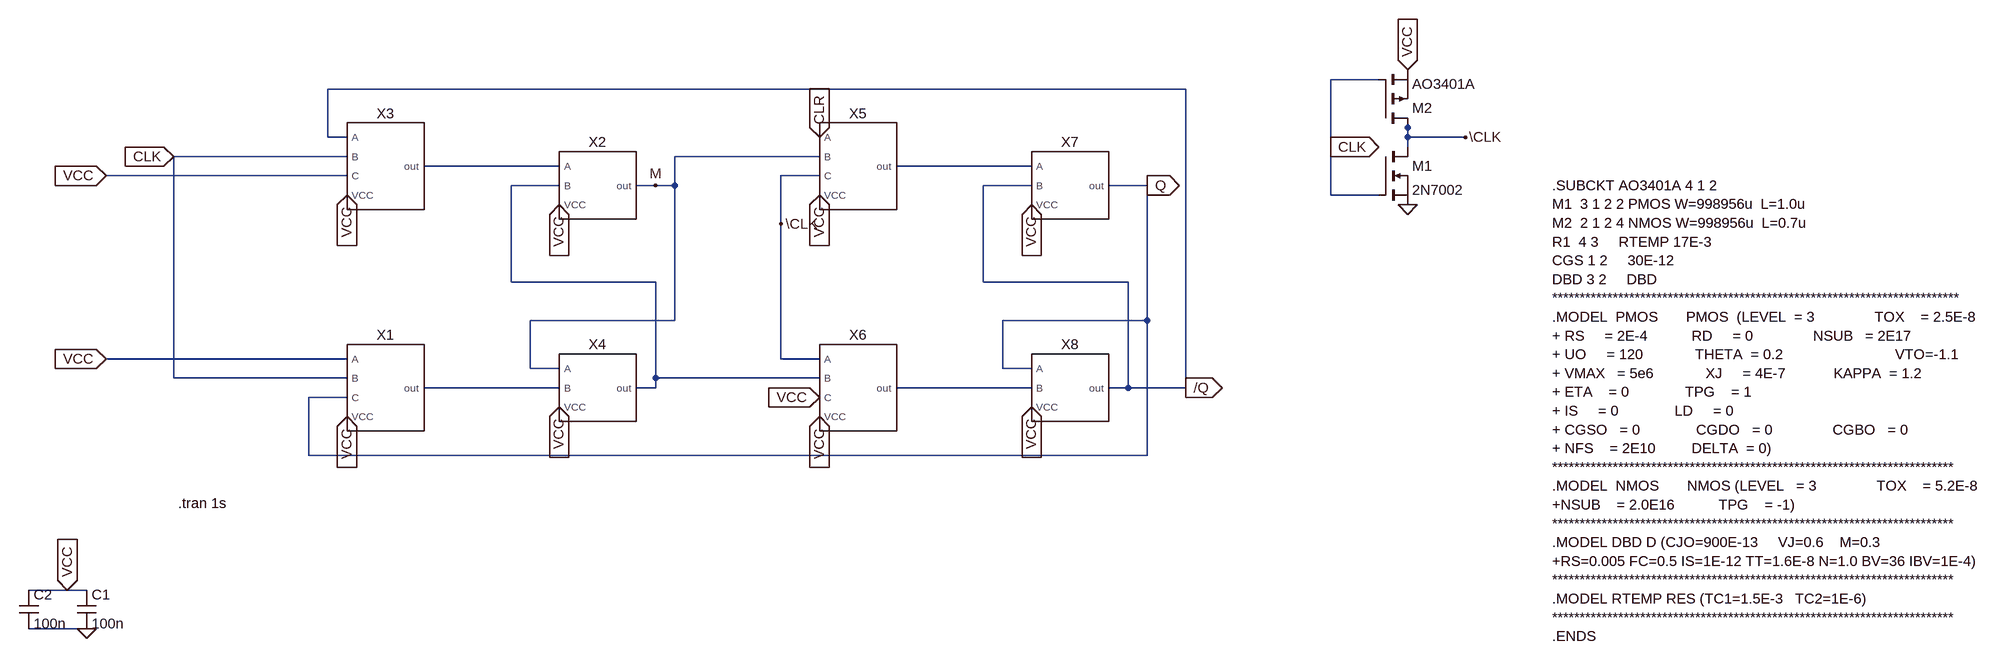
[diagram p0: schematic flipflop-test.asc]
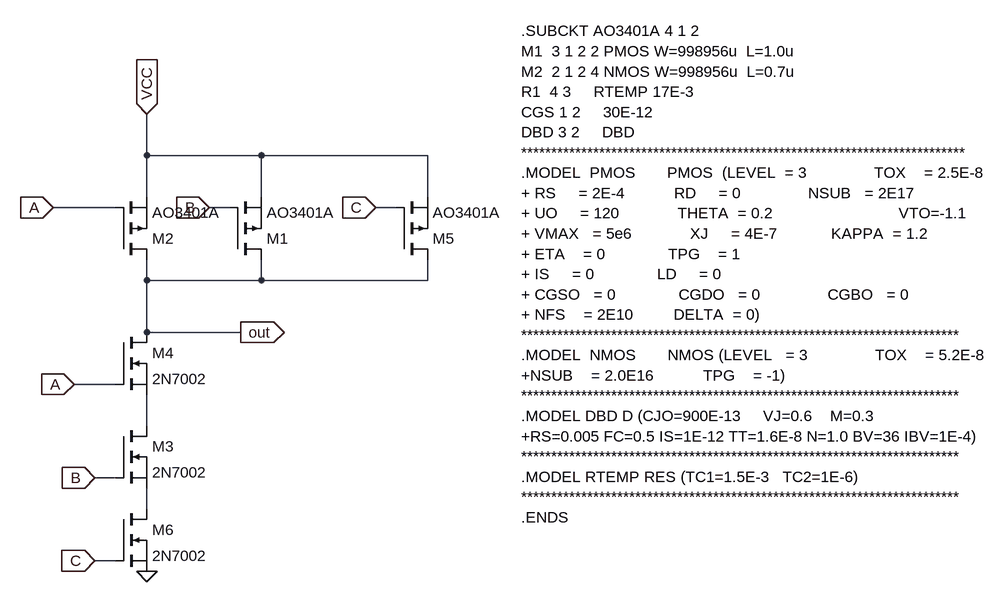
[diagram p1: sub-circuit nand3-gate.asc]
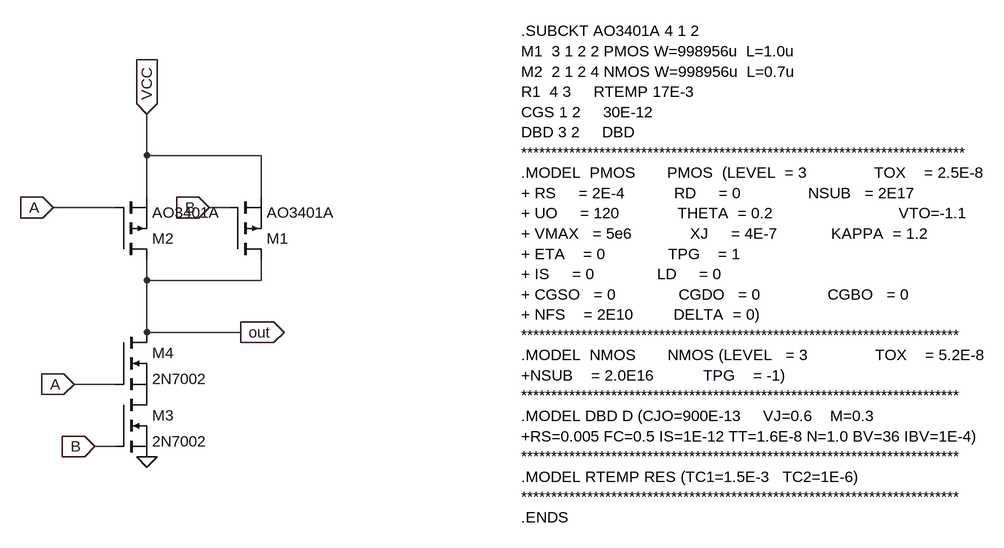
[diagram p2: sub-circuit nand-gate.asc]
flipflop-test.asc, the LTspice schematic file:
Version 4.1
SHEET 1 3088 948
WIRE 1712 -48 1632 -48
WIRE 1392 -32 -32 -32
WIRE 1760 32 1760 16
WIRE -32 48 -32 -32
WIRE 0 48 -32 48
WIRE 1760 48 1760 32
WIRE 1856 48 1760 48
WIRE 1632 64 1632 -48
WIRE 1760 64 1760 48
WIRE 0 80 -288 80
WIRE 784 80 544 80
WIRE 352 96 128 96
WIRE 1136 96 912 96
WIRE 0 112 -400 112
WIRE 784 112 720 112
WIRE 352 128 272 128
WIRE 512 128 480 128
WIRE 544 128 544 80
WIRE 544 128 512 128
WIRE 1136 128 1056 128
WIRE 1328 128 1264 128
WIRE 1632 144 1632 64
WIRE 1712 144 1632 144
WIRE 720 192 720 112
WIRE 272 288 272 128
WIRE 512 288 272 288
WIRE 1056 288 1056 128
WIRE 1296 288 1056 288
WIRE 544 352 544 128
WIRE 544 352 304 352
WIRE 1328 352 1328 128
WIRE 1328 352 1088 352
WIRE 0 416 -400 416
WIRE 720 416 720 192
WIRE 784 416 720 416
WIRE 304 432 304 352
WIRE 352 432 304 432
WIRE 1088 432 1088 352
WIRE 1136 432 1088 432
WIRE -288 448 -288 80
WIRE 0 448 -288 448
WIRE 512 448 512 288
WIRE 784 448 512 448
WIRE 352 464 128 464
WIRE 512 464 512 448
WIRE 512 464 480 464
WIRE 1136 464 912 464
WIRE 1296 464 1296 288
WIRE 1296 464 1264 464
WIRE 1392 464 1392 -32
WIRE 1392 464 1296 464
WIRE 0 480 -64 480
WIRE -64 576 -64 480
WIRE 1328 576 1328 352
WIRE 1328 576 -64 576
WIRE -464 800 -528 800
WIRE -432 800 -464 800
WIRE -432 864 -528 864
FLAG -288 80 CLK
IOPIN -288 80 In
FLAG 1328 128 Q
IOPIN 1328 128 Out
FLAG 1392 464 /Q
IOPIN 1392 464 Out
FLAG 512 128 M
FLAG 1632 64 CLK
IOPIN 1632 64 Out
FLAG 1760 160 0
FLAG 1856 48 \CLK
FLAG 720 192 \CLK
FLAG -400 112 VCC
IOPIN -400 112 In
FLAG -464 800 VCC
IOPIN -464 800 In
FLAG -432 864 0
FLAG -400 416 VCC
IOPIN -400 416 In
FLAG 0 144 VCC
IOPIN 0 144 In
FLAG 0 512 VCC
IOPIN 0 512 In
FLAG 352 496 VCC
IOPIN 352 496 In
FLAG 352 160 VCC
IOPIN 352 160 In
FLAG 784 512 VCC
IOPIN 784 512 In
FLAG 784 480 VCC
IOPIN 784 480 In
FLAG 784 144 VCC
IOPIN 784 144 In
FLAG 1136 160 VCC
IOPIN 1136 160 In
FLAG 1136 496 VCC
IOPIN 1136 496 In
FLAG 1760 -64 VCC
IOPIN 1760 -64 In
FLAG 784 48 CLR
IOPIN 784 48 In
SYMBOL nand3-gate 64 96 R0
SYMATTR InstName X3
SYMBOL nand3-gate 64 464 R0
SYMATTR InstName X1
SYMBOL nand-gate 416 128 R0
SYMATTR InstName X2
SYMBOL nand-gate 416 464 R0
SYMATTR InstName X4
SYMBOL nand3-gate 848 96 R0
SYMATTR InstName X5
SYMBOL nand3-gate 848 464 R0
SYMATTR InstName X6
SYMBOL nand-gate 1200 128 R0
SYMATTR InstName X7
SYMBOL nand-gate 1200 464 R0
SYMATTR InstName X8
SYMBOL nmos 1712 64 R0
SYMATTR InstName M1
SYMATTR Value 2N7002
SYMBOL pmos 1712 32 M180
SYMATTR InstName M2
SYMATTR Value AO3401A
SYMATTR Prefix X
SYMBOL cap -448 800 R0
SYMATTR InstName C1
SYMATTR Value 100n
SYMBOL cap -544 800 R0
SYMATTR InstName C2
SYMATTR Value 100n
TEXT -280 656 Left 2 !.tran 1s
TEXT 2000 128 Left 2 !.SUBCKT AO3401A 4 1 2\nM1  3 1 2 2 PMOS W=998956u  L=1.0u \nM2  2 1 2 4 NMOS W=998956u  L=0.7u\nR1  4 3     RTEMP 17E-3\nCGS 1 2     30E-12\nDBD 3 2     DBD\n**************************************************************************\n.MODEL  PMOS       PMOS  (LEVEL  = 3               TOX    = 2.5E-8\n+ RS     = 2E-4           RD     = 0               NSUB   = 2E17  \n+ UO     = 120             THETA  = 0.2                            VTO=-1.1\n+ VMAX   = 5e6             XJ     = 4E-7            KAPPA  = 1.2\n+ ETA    = 0              TPG    = 1  \n+ IS     = 0              LD     = 0                           \n+ CGSO   = 0              CGDO   = 0               CGBO   = 0 \n+ NFS    = 2E10         DELTA  = 0)\n*************************************************************************\n.MODEL  NMOS       NMOS (LEVEL   = 3               TOX    = 5.2E-8\n+NSUB    = 2.0E16           TPG    = -1)   \n*************************************************************************\n.MODEL DBD D (CJO=900E-13     VJ=0.6    M=0.3\n+RS=0.005 FC=0.5 IS=1E-12 TT=1.6E-8 N=1.0 BV=36 IBV=1E-4)\n*************************************************************************\n.MODEL RTEMP RES (TC1=1.5E-3   TC2=1E-6)\n*************************************************************************\n.ENDS

nand3-gate.asc, the sub-circuit schematic file:
Version 4.1
SHEET 1 2000 824
WIRE 336 128 336 64
WIRE 512 128 336 128
WIRE 768 128 512 128
WIRE 336 192 336 128
WIRE 512 192 512 128
WIRE 768 192 768 128
WIRE 288 208 192 208
WIRE 464 208 432 208
WIRE 720 208 688 208
WIRE 336 320 336 288
WIRE 512 320 512 288
WIRE 512 320 336 320
WIRE 768 320 768 288
WIRE 768 320 512 320
WIRE 336 400 336 320
WIRE 480 400 336 400
WIRE 288 480 224 480
WIRE 336 544 336 496
WIRE 288 624 256 624
WIRE 336 672 336 640
WIRE 288 752 256 752
FLAG 192 208 A
IOPIN 192 208 In
FLAG 224 480 A
IOPIN 224 480 In
FLAG 432 208 B
IOPIN 432 208 In
FLAG 256 624 B
IOPIN 256 624 In
FLAG 480 400 out
IOPIN 480 400 Out
FLAG 256 752 C
IOPIN 256 752 In
FLAG 688 208 C
IOPIN 688 208 In
FLAG 336 768 0
FLAG 336 64 VCC
IOPIN 336 64 In
SYMBOL pmos 464 288 M180
SYMATTR InstName M1
SYMATTR Value AO3401A
SYMATTR Prefix X
SYMBOL pmos 288 288 M180
SYMATTR InstName M2
SYMATTR Value AO3401A
SYMATTR Prefix X
SYMBOL nmos 288 400 R0
SYMATTR InstName M4
SYMATTR Value 2N7002
SYMBOL nmos 288 544 R0
SYMATTR InstName M3
SYMATTR Value 2N7002
SYMBOL pmos 720 288 M180
SYMATTR InstName M5
SYMATTR Value AO3401A
SYMATTR Prefix X
SYMBOL nmos 288 672 R0
SYMATTR InstName M6
SYMATTR Value 2N7002
TEXT 912 -64 Left 2 !.SUBCKT AO3401A 4 1 2\nM1  3 1 2 2 PMOS W=998956u  L=1.0u \nM2  2 1 2 4 NMOS W=998956u  L=0.7u\nR1  4 3     RTEMP 17E-3\nCGS 1 2     30E-12\nDBD 3 2     DBD\n**************************************************************************\n.MODEL  PMOS       PMOS  (LEVEL  = 3               TOX    = 2.5E-8\n+ RS     = 2E-4           RD     = 0               NSUB   = 2E17  \n+ UO     = 120             THETA  = 0.2                            VTO=-1.1\n+ VMAX   = 5e6             XJ     = 4E-7            KAPPA  = 1.2\n+ ETA    = 0              TPG    = 1  \n+ IS     = 0              LD     = 0                           \n+ CGSO   = 0              CGDO   = 0               CGBO   = 0 \n+ NFS    = 2E10         DELTA  = 0)\n*************************************************************************\n.MODEL  NMOS       NMOS (LEVEL   = 3               TOX    = 5.2E-8\n+NSUB    = 2.0E16           TPG    = -1)   \n*************************************************************************\n.MODEL DBD D (CJO=900E-13     VJ=0.6    M=0.3\n+RS=0.005 FC=0.5 IS=1E-12 TT=1.6E-8 N=1.0 BV=36 IBV=1E-4)\n*************************************************************************\n.MODEL RTEMP RES (TC1=1.5E-3   TC2=1E-6)\n*************************************************************************\n.ENDS

nand-gate.asc, the sub-circuit schematic file:
Version 4.1
SHEET 1 2000 712
WIRE 336 128 336 64
WIRE 512 128 336 128
WIRE 336 192 336 128
WIRE 512 192 512 128
WIRE 288 208 192 208
WIRE 464 208 432 208
WIRE 336 320 336 288
WIRE 512 320 512 288
WIRE 512 320 336 320
WIRE 336 400 336 320
WIRE 480 400 336 400
WIRE 288 480 224 480
WIRE 288 576 256 576
FLAG 192 208 A
IOPIN 192 208 In
FLAG 224 480 A
IOPIN 224 480 In
FLAG 432 208 B
IOPIN 432 208 In
FLAG 256 576 B
IOPIN 256 576 In
FLAG 336 592 0
FLAG 480 400 out
IOPIN 480 400 Out
FLAG 336 64 VCC
IOPIN 336 64 In
SYMBOL pmos 464 288 M180
SYMATTR InstName M1
SYMATTR Value AO3401A
SYMATTR Prefix X
SYMBOL pmos 288 288 M180
SYMATTR InstName M2
SYMATTR Value AO3401A
SYMATTR Prefix X
SYMBOL nmos 288 400 R0
SYMATTR InstName M4
SYMATTR Value 2N7002
SYMBOL nmos 288 496 R0
SYMATTR InstName M3
SYMATTR Value 2N7002
TEXT 912 -64 Left 2 !.SUBCKT AO3401A 4 1 2\nM1  3 1 2 2 PMOS W=998956u  L=1.0u \nM2  2 1 2 4 NMOS W=998956u  L=0.7u\nR1  4 3     RTEMP 17E-3\nCGS 1 2     30E-12\nDBD 3 2     DBD\n**************************************************************************\n.MODEL  PMOS       PMOS  (LEVEL  = 3               TOX    = 2.5E-8\n+ RS     = 2E-4           RD     = 0               NSUB   = 2E17  \n+ UO     = 120             THETA  = 0.2                            VTO=-1.1\n+ VMAX   = 5e6             XJ     = 4E-7            KAPPA  = 1.2\n+ ETA    = 0              TPG    = 1  \n+ IS     = 0              LD     = 0                           \n+ CGSO   = 0              CGDO   = 0               CGBO   = 0 \n+ NFS    = 2E10         DELTA  = 0)\n*************************************************************************\n.MODEL  NMOS       NMOS (LEVEL   = 3               TOX    = 5.2E-8\n+NSUB    = 2.0E16           TPG    = -1)   \n*************************************************************************\n.MODEL DBD D (CJO=900E-13     VJ=0.6    M=0.3\n+RS=0.005 FC=0.5 IS=1E-12 TT=1.6E-8 N=1.0 BV=36 IBV=1E-4)\n*************************************************************************\n.MODEL RTEMP RES (TC1=1.5E-3   TC2=1E-6)\n*************************************************************************\n.ENDS

The netlist it stands for:
* flipflop-test.asc
X§X3 /Q CLK VCC VCC N001 nand3-gate
X§X1 VCC CLK Q VCC N004 nand3-gate
X§X2 N001 N003 VCC M nand-gate
X§X4 M N004 VCC N003 nand-gate
X§X5 CLR M \CLK VCC N002 nand3-gate
X§X6 \CLK N003 VCC VCC N005 nand3-gate
X§X7 N002 /Q VCC Q nand-gate
X§X8 Q N005 VCC /Q nand-gate
M1 \CLK CLK 0 0 2N7002
X§M2 \CLK CLK VCC AO3401A  ; pins D G S
C1 VCC 0 100n
C2 VCC 0 100n

* block symbol definitions
.subckt nand3-gate A B C VCC out
X§M1 out B VCC AO3401A  ; pins D G S
X§M2 out A VCC AO3401A  ; pins D G S
M4 out A N001 N001 2N7002
M3 N001 B N002 N002 2N7002
X§M5 out C VCC AO3401A  ; pins D G S
M6 N002 C 0 0 2N7002
.SUBCKT AO3401A 4 1 2
M1  3 1 2 2 PMOS W=998956u  L=1.0u
M2  2 1 2 4 NMOS W=998956u  L=0.7u
R1  4 3     RTEMP 17E-3
CGS 1 2     30E-12
DBD 3 2     DBD
**************************************************************************
.MODEL  PMOS       PMOS  (LEVEL  = 3               TOX    = 2.5E-8
+ RS     = 2E-4           RD     = 0               NSUB   = 2E17
+ UO     = 120             THETA  = 0.2                            VTO=-1.1
+ VMAX   = 5e6             XJ     = 4E-7            KAPPA  = 1.2
+ ETA    = 0              TPG    = 1
+ IS     = 0              LD     = 0
+ CGSO   = 0              CGDO   = 0               CGBO   = 0
+ NFS    = 2E10         DELTA  = 0)
*************************************************************************
.MODEL  NMOS       NMOS (LEVEL   = 3               TOX    = 5.2E-8
+NSUB    = 2.0E16           TPG    = -1)
*************************************************************************
.MODEL DBD D (CJO=900E-13     VJ=0.6    M=0.3
+RS=0.005 FC=0.5 IS=1E-12 TT=1.6E-8 N=1.0 BV=36 IBV=1E-4)
*************************************************************************
.MODEL RTEMP RES (TC1=1.5E-3   TC2=1E-6)
*************************************************************************
.ENDS
.ends nand3-gate

.subckt nand-gate A B VCC out
X§M1 out B VCC AO3401A  ; pins D G S
X§M2 out A VCC AO3401A  ; pins D G S
M4 out A P001 P001 2N7002
M3 P001 B 0 0 2N7002
.SUBCKT AO3401A 4 1 2
M1  3 1 2 2 PMOS W=998956u  L=1.0u
M2  2 1 2 4 NMOS W=998956u  L=0.7u
R1  4 3     RTEMP 17E-3
CGS 1 2     30E-12
DBD 3 2     DBD
**************************************************************************
.MODEL  PMOS       PMOS  (LEVEL  = 3               TOX    = 2.5E-8
+ RS     = 2E-4           RD     = 0               NSUB   = 2E17
+ UO     = 120             THETA  = 0.2                            VTO=-1.1
+ VMAX   = 5e6             XJ     = 4E-7            KAPPA  = 1.2
+ ETA    = 0              TPG    = 1
+ IS     = 0              LD     = 0
+ CGSO   = 0              CGDO   = 0               CGBO   = 0
+ NFS    = 2E10         DELTA  = 0)
*************************************************************************
.MODEL  NMOS       NMOS (LEVEL   = 3               TOX    = 5.2E-8
+NSUB    = 2.0E16           TPG    = -1)
*************************************************************************
.MODEL DBD D (CJO=900E-13     VJ=0.6    M=0.3
+RS=0.005 FC=0.5 IS=1E-12 TT=1.6E-8 N=1.0 BV=36 IBV=1E-4)
*************************************************************************
.MODEL RTEMP RES (TC1=1.5E-3   TC2=1E-6)
*************************************************************************
.ENDS
.ends nand-gate

.model NMOS NMOS
.model PMOS PMOS
.lib standard.mos
.tran 1s
.SUBCKT AO3401A 4 1 2
M1  3 1 2 2 PMOS W=998956u  L=1.0u
M2  2 1 2 4 NMOS W=998956u  L=0.7u
R1  4 3     RTEMP 17E-3
CGS 1 2     30E-12
DBD 3 2     DBD
**************************************************************************
.MODEL  PMOS       PMOS  (LEVEL  = 3               TOX    = 2.5E-8
+ RS     = 2E-4           RD     = 0               NSUB   = 2E17
+ UO     = 120             THETA  = 0.2                            VTO=-1.1
+ VMAX   = 5e6             XJ     = 4E-7            KAPPA  = 1.2
+ ETA    = 0              TPG    = 1
+ IS     = 0              LD     = 0
+ CGSO   = 0              CGDO   = 0               CGBO   = 0
+ NFS    = 2E10         DELTA  = 0)
*************************************************************************
.MODEL  NMOS       NMOS (LEVEL   = 3               TOX    = 5.2E-8
+NSUB    = 2.0E16           TPG    = -1)
*************************************************************************
.MODEL DBD D (CJO=900E-13     VJ=0.6    M=0.3
+RS=0.005 FC=0.5 IS=1E-12 TT=1.6E-8 N=1.0 BV=36 IBV=1E-4)
*************************************************************************
.MODEL RTEMP RES (TC1=1.5E-3   TC2=1E-6)
*************************************************************************
.ENDS
.backanno
.end